# Altium project Timing Display Board v1.1.PrjPcb (part 2 of 2)

## Sheet Interface.SchDoc
size OrCAD C; SheetNumber: 7; SheetTotal: 7
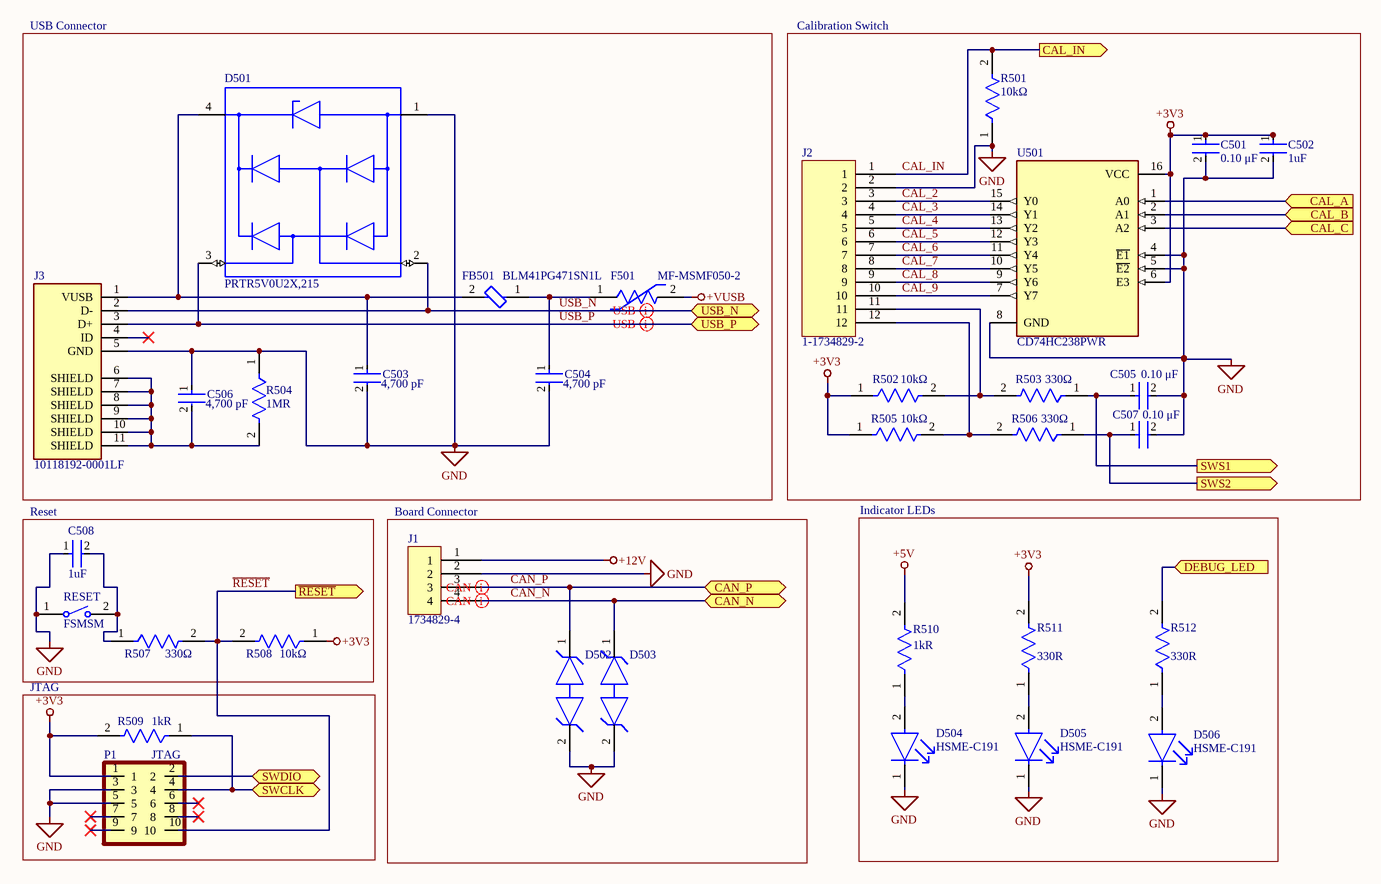
[diagram p5: Interface.SchDoc]

### Parts
C501  Capacitance: 0.10 μF  [FP-C0603C-CF-MFG]  (hidden comment: C0603C104K5RACAUTO)
C502  Capacitance: 1uF  [FP-C0603C-CJ-MFG]  (hidden comment: C0603C105K4RACAUTO)
C503  Capacitance: 4,700 pF  [FP-C0603C-CF-MFG]  (hidden comment: C0603C472K5RACAUTO)
C504  Capacitance: 4,700 pF  [FP-C0603C-CF-MFG]  (hidden comment: C0603C472K5RACAUTO)
C505  Capacitance: 0.10 μF  [FP-C0603C-CF-MFG]  (hidden comment: C0603C104K5RACAUTO)
C506  Capacitance: 4,700 pF  [FP-C0603C-CF-MFG]  (hidden comment: C0603C472K5RACAUTO)
C507  Capacitance: 0.10 μF  [FP-C0603C-CF-MFG]  (hidden comment: C0603C104K5RACAUTO)
C508  Capacitance: 1uF  [FP-C0603C-CJ-MFG]  (hidden comment: C0603C105K4RACAUTO)
D501  PRTR5V0U2X,215  [FP-SOT143B-MFG]
D502  SD24C-01FTG  [FP-SD-C-MFG]  (value not drawn)
D503  SD24C-01FTG  [FP-SD-C-MFG]  (value not drawn)
D504  HSME-C191  [FP-HSME-C191-MFG]
D505  HSME-C191  [FP-HSME-C191-MFG]
D506  HSME-C191  [FP-HSME-C191-MFG]
F501  MF-MSMF050-2  [FP-MF-MSMF050-2-MFG]
FB501  BLM41PG471SN1L  [FP-BLM41-0_2-a1_2-IPC_B]
J1  1734829-4  [1734829-4]
J2  1-1734829-2  [1-1734829-2]
J3  10118192-0001LF  [101181920001LF]
P1  JTAG  [FCI_20021111-00010T4LF]
R501  Resistance: 10kΩ  [FP-RMCF0603-IPC_C]  (hidden comment: RMCF0603JT10K0)
R502  Resistance: 10kΩ  [FP-RMCF0603-IPC_C]  (hidden comment: RMCF0603JT10K0)
R503  Resistance: 330Ω  [FP-RMCF0603-MFG]  (hidden comment: RMCF0603JT330R)
R504  Resistance: 1MR  [FP-RMCF0603-IPC_B]  (hidden comment: RMCF0603JT1M00)
R505  Resistance: 10kΩ  [FP-RMCF0603-IPC_C]  (hidden comment: RMCF0603JT10K0)
R506  Resistance: 330Ω  [FP-RMCF0603-MFG]  (hidden comment: RMCF0603JT330R)
R507  Resistance: 330Ω  [FP-RMCF0603-MFG]  (hidden comment: RMCF0603JT330R)
R508  Resistance: 10kΩ  [FP-RMCF0603-IPC_C]  (hidden comment: RMCF0603JT10K0)
R509  Resistance: 1kR  [FP-RMCF0603-IPC_C]  (hidden comment: RMCF0603JT1K00)
R510  Resistance: 1kR  [FP-TNPW0603-e3-IPC_B]  (hidden comment: TNPW06031K00BEEA)
R511  Resistance: 330R  [FP-RMCF0603-MFG]  (hidden comment: RMCF0603FT330R)
R512  Resistance: 330R  [FP-RMCF0603-MFG]  (hidden comment: RMCF0603FT330R)
RESET  FSMSM  [TECO-FSMSM-2_V]
U501  CD74HC238PWR  [FP-PW0016A-IPC_B]

### Blocks framed on the sheet
USB Connector: C503 C504 C506 D501 F501 FB501 J3 R504
Calibration Switch: C501 C502 C505 C507 J2 R501-R503 R505 R506 U501
Reset: C508 R507 R508 RESET
Board Connector: D502 D503 J1
Indicator LEDs: D504-D506 R510-R512
JTAG: P1 R509

### Ports
CAL_A (in), CAL_B (in), CAL_C (in), CAL_IN (out), CAN_N (bidir), CAN_P (bidir), DEBUG_LED (in), SWCLK (bidir), SWDIO (bidir), SWS1 (out), SWS2 (out), USB_N (bidir), USB_P (bidir), ~{RESET} (out)

### Nets
+3V3: C501.1 C502.1 P1.1 R502.1 R505.1 R508.1 R509.2 R511.2 U501.6(E3) U501.16(VCC)
+5V: R510.2
+12V: J1.1
+VUSB: F501.2
GND: C501.2 C502.2 C503.2 C504.2 C505.2 C506.1 C507.2 C508.1 D501.1(GND) D502.2 D503.2 D504.1(C) D505.1(C) D506.1(C) J1.2 J2.2 J3.5(GND) P1.3 P1.5 R501.1 R504.1 RESET.1 U501.4(~{E1}) U501.5(~{E2}) U501.8(GND)
CAL_2: J2.3 U501.15(Y0)
CAL_3: J2.4 U501.14(Y1)
CAL_4: J2.5 U501.13(Y2)
CAL_5: J2.6 U501.12(Y3)
CAL_6: J2.7 U501.11(Y4)
CAL_7: J2.8 U501.10(Y5)
CAL_8: J2.9 U501.9(Y6)
CAL_9: J2.10 U501.7(Y7)
CAL_A: U501.1(A0) ; port CAL_A
CAL_B: U501.2(A1) ; port CAL_B
CAL_C: U501.3(A2) ; port CAL_C
CAL_IN: J2.1 R501.2 ; port CAL_IN
CAN_N: D503.1 J1.4 ; port CAN_N
CAN_P: D502.1 J1.3 ; port CAN_P
DEBUG_LED: R512.2 ; port DEBUG_LED
~{RESET}: P1.10 R507.2 R508.2 ; port ~{RESET}
SWCLK: P1.4 R509.1 ; port SWCLK
SWDIO: P1.2 ; port SWDIO
SWS1: C505.1 R503.1 ; port SWS1
SWS2: C507.1 R506.1 ; port SWS2
USB_N: D501.2(I/O_1) J3.2(D-) ; port USB_N
USB_P: D501.3(I/O_2) J3.3(D+) ; port USB_P
NetC503_1: C503.1 D501.4(VCC) FB501.2 J3.1(VUSB)
NetC504_1: C504.1 F501.1 FB501.1
NetC506_2: C506.2 J3.6(SHIELD) J3.7(SHIELD) J3.8(SHIELD) J3.9(SHIELD) J3.10(SHIELD) J3.11(SHIELD) R504.2
NetC508_2: C508.2 R507.1 RESET.2
NetD504_2: D504.2(A) R510.1
NetD505_2: D505.2(A) R511.1
NetD506_2: D506.2(A) R512.1
NetJ2_11: J2.11 R502.2 R503.2
NetJ2_12: J2.12 R505.2 R506.2

Not connected (* = marked no-connect by the designer): J3 4(ID)*; P1 6* 7* 8* 9*

### Layout directives
differential pair: CAN_N, CAN_P, USB_N, USB_P

### Library data of the parts
C501 C505 C507 = CMP-2006-03060-2: CAP CER 0.1UF 50V X7R 0603; Manufacturer: KEMET; Tolerance: 0.1; Material: Ceramic; Value: 0.10 μF; Automotive Grade: Grade 1; Temperature Coefficient: 30ppm/°C; RoHS: TRUE; Temperature Range Low: -55°C; Automotive: Yes; Octopart: https://octopart.com/c0603c104k5racauto-kemet-12563741; Temperature Characteristic: X7R; Category: Cap; Voltage Rating: 50 V; Mouser Description: Multilayer Ceramic Capacitors MLCC - SMD/SMT 0.1uF 50volts 10% X7R AUTO; ComponentLink2Description: Datasheet; Device Class L2: Capacitors; Digikey Description: CAP CER 0.1UF 50V X7R 0603; Manufacturer Part Number: C0603C104K5RACAUTO; ComponentLink2URL: https://api.kemet.com/component-edge/download/datasheet/C0603C100J5GACAUTO.pdf; Lead Free: Yes; Height: 0.87mm; Device Class L3: Ceramic Capacitors; Device Class L1: Passive Components; Temperature Range High: +125°C; Package: C0603C-CF; Temperature: -55°C to +125°C
C502 C508 = CMP-03020-014193-1: CAP CER 0603 1UF 16V X7R 10%; Manufacturer: KEMET; Temperature Coefficient: 15%; Automotive Grade: Grade 1; Material: Ceramic; Digikey Description: CAP CER 0603 1UF 16V X7R 10%; Octopart: https://octopart.com/c0603c105k4racauto-kemet-91328491; Package: C0603C-CJ; ComponentLink2Description: Datasheet; Mouser Description: Cap Ceramic 1uF 16V X7R 10% Pad SMD 0603 125C Automotive T/R; Automotive: Yes; Tolerance: 10%; Manufacturer Part Number: C0603C105K4RACAUTO; Lead Free: Yes; Temperature: -55°C to +125°C; ComponentLink2URL: https://content.kemet.com/datasheets/KEM_C1023_X7R_AUTO_SMD.pdf; Temperature Range Low: -55°C; Ipc Land Pattern Name: CAPC16080X80; Device Class L1: Passive Components; Temperature Characteristic: X7R; Device Class L2: Capacitors; Height: 0.95mm; Device Class L3: Ceramic Capacitors; RoHS: TRUE; Category: Cap; Temperature Range High: +125°C; Value: 1uF; Voltage Rating: 16V
C503 C504 C506 = CMP-2006-03717-2: CAP CER 4700PF 50V X7R 0603; Manufacturer: KEMET; Automotive Grade: Grade 1; Material: Ceramic; Tolerance: 0.1; Value: 4,700 pF; Temperature Coefficient: 30ppm/°C; Device Class L3: Ceramic Capacitors; Manufacturer Part Number: C0603C472K5RACAUTO; Octopart: https://octopart.com/c0603c472k5racauto-kemet-20122456; RoHS: TRUE; Temperature Range Low: -55°C; Temperature Characteristic: X7R; Device Class L1: Passive Components; ComponentLink2Description: Datasheet; Temperature: -55°C to +125°C; Package: C0603C-CF; ComponentLink2URL: https://api.kemet.com/component-edge/download/datasheet/C0603C100J5GACAUTO.pdf; Device Class L2: Capacitors; Voltage Rating: 50 V; Digikey Description: CAP CER 4700PF 50V X7R 0603; Temperature Range High: +125°C; Height: 0.87mm; Category: Cap; Lead Free: Yes; Mouser Description: Cap Ceramic 0.0047uF 50V X7R 10% Pad SMD 0603 125C Automotive T/R; Automotive: Yes
D501 = CMP-14436-000007-1: TVS DIODE 5.5V SOT143B
D502 D503 = CMP-08607-000005-1: TVS DIODE 24V 42V SOD323; Manufacturer: Littelfuse; Peak Pulse Power: 450W; Direction: Bidirectional; Standoff Height: 0mm; Capacitance: 50pF; Number Of Channels: 1; Value: 50pF; Breakdown Voltage: 26.7V; Peak Pulse Current: 7A; Automotive Grade: Grade 1; Category: Diode; Mouser Description: In a Pack of 25, Littelfuse SD24C-01FTG, Bi-Directional TVS Diode Array, 450W, 2-Pin SOD-323; Height: 1.14mm; Manufacturer Part Number: SD24C-01FTG; Octopart: https://octopart.com/sd24c-01ftg-littelfuse-46947705; Temperature Range High: +125°C; Reverse Standoff Voltage: 24V; ComponentLink2Description: Datasheet; Device Class L2: TVS Diodes; Lead Free: Yes; Automotive: Yes; Temperature Range Low: -40°C; Device Class L3: unset; Device Class L1: Circuit Protection; ComponentLink2URL: https://www.littelfuse.com/~/media/electronics/datasheets/tvs_diode_arrays/littelfuse_tvs_diode_array_sd_c_datasheet.pdf.pdf; Clamping Voltage: 42V; Digikey Description: TVS DIODE 24V 42V SOD323; RoHS: TRUE; Temperature: -40°C to +125°C; Package: SD-C
D504-D506 = CMP-18399-000013-1: LED GREEN DIFFUSED 0603 SMD; Manufacturer: Broadcom; Forward Current: 20mA; Reverse Voltage: 5V; Forward Voltage: 2.1V; Viewing Angle: 170°; Wavelength: 572nm; Power Dissipation: 52mW; Max Junction Temp: +95°C; Luminous Intensity: 50mcd; Led Orientation: Top View; Description: LED Uni-Color Green 570nm 2-Pin Chip LED T/R; Peak Emmision Wavelength: 570nm; Package: 0; Category: Diode; ComponentLink2URL: https://docs.broadcom.com/docs/AV02-0976EN; ComponentLink2Description: Datasheet; Device Class L2: LEDs; Digikey Description: LED GREEN DIFFUSED 0603 SMD; Height: 0.7mm; RoHS: TRUE; Colour: Green; Lead Free: Yes; Device Class L1: Optoelectronics; Device Class L3: unset; Temperature Range High: +85°C; Manufacturer Part Number: HSME-C191; Automotive: No; Temperature: -40°C to +85°C; Octopart: https://octopart.com/hsme-c191-broadcom-71131261; Mouser Description: Standard LEDs - SMD AlInGaP Green; Temperature Range Low: -40°C
F501 = CMP-2100-03653-2: PTC RESET FUSE 15V 500MA 1812; Manufacturer: Bourns; Value: 0.15-1Ω; Trip Current: 1A; Automotive Grade: Grade 3; Trip Time: 0.15s; Current Rating: 100A; Hold Current: 0.5A; Height: 0.85mm; Package: 1812; Voltage Rating: 15V; Temperature Range High: +85°C; Device Class L2: PTC Resettable Fuses; Lead Free: Yes; ComponentLink2URL: http://www.bourns.com/docs/Product-Datasheets/mfmsmf.pdf; Ambient Temperature Range High: +85°C; Mouser Description: PTC Resettable Fuse 0.5A(hold) 1A(trip) 15V 100A 0.8W 0.15s 0.15Ohm SMD Solder Pad 1812 T/R; Digikey Description: PTC RESET FUSE 15V 500MA 1812; Manufacturer Part Number: MF-MSMF050-2; Resistance: 0.15-1Ω; Category: Fuse; ComponentLink2Description: Datasheet; Automotive: Yes; Temperature Range Low: -40°C; RoHS: TRUE; Device Class L1: Circuit Protection; Temperature: -40°C to +85°C; Octopart: https://octopart.com/mf-msmf050-2-bourns-28047; Ambient Temperature Range Low: -40°C; Device Class L3: unset
FB501 = CMP-0686-00760-3: Ferrite Bead, 1806, 470Ω @ 100MHz, 25%, 0.05Ω, 2A; Material: Steel; Number of Circuits: 1; Shielding: Unshielded; DC Resistance (DCR): 50mR; Impedance: 470R; Min Operating Temperature: -55°C; Case/Package: 1806; Packaging: Tape and Reel; DC Current: 2A; Frequency: 100MHz; Length: 4.5mm; Max Operating Temperature: 125°C; Package Quantity: 1; Max Current Rating: 2A; Radiation Hardening: No; RoHS Compliant: Yes; Lead Free: Lead Free; Height: 1.6mm; Test Frequency: 100MHz; Series: BLM41P; Width: 1.6mm; Core Material: Ferrite; Case Code (Imperial): 1806; Termination: SMD/SMT; Tolerance: 25%; Number of Pins: 2; Number of Lines: 1; Case Code (Metric): 4516; Current Rating: 2A; Max DC Current: 2A; DC Resistance-Max: 50mR; Depth: 1.6mm; Military Standard: Not
J1 = 1734829-4: Headers & Wire Housings 4 POS HDR R/A 1.25mm; Supplier 1: Mouser; Supplier Part Number 1: 571-1734829-4
J2 = 1-1734829-2: Headers & Wire Housings 12 POS HDR R/A 1.25mm; Supplier 1: Mouser; Supplier Part Number 1: 571-1-1734829-2
J3 = CMP-005-000001-1: Connector; Manufacturer_Name: Amphenol; Mouser2 Price/Stock: https://www.mouser.com/Search/Refine.aspx?Keyword=649-10118192-0001LF; Source: SamacSys.SchLib; Design Item ID: 10118192-0001LF; Manufacturer_Part_Number: 10118192-0001LF; Datasheet Link: https://componentsearchengine.com//10118192-0001LF.pdf; Height: 2.8mm; Mouser2 Part Number: 649-10118192-0001LF
P1 = 20021111-00010T4LF: 1.27x1.27MM BTB, HEADER UNSHROUDED, VERTICAL, TH, 10 POSITIONSÂ£Â¬Double row; MF: {'manufacturer': u'AMPHENOL ICC / FCI'}; Value: *; MP: 20021111-00010T4LF; Package: None; Price: None; Availability: Unavailable
R501 R502 R505 R508 = CMP-26527-002098-1: 10kΩ ±5% 0.1W 0603 Thick Film Chip Resistor AEC-Q200 compliant; Power Rating: 100mW; Temperature Coefficient: 100ppm/°C; Radiation Hardening: No; Military Standard: Not; Mount: Surface Mount; Resistor Type: Thick Film; Size Code: 0603; Case/Package: 0603; Min Operating Temperature: -55°C; Construction: Rectangular; Series: RMCF; Width: 0.031inch; Length: 1.55mm; Case Code (Metric): 1608; Depth: 0.8mm; Height: 0.022inch; Packaging: Tape and Reel; Lead Free: Lead Free; Tolerance: 5%; Case Code (Imperial): 0603; Max Operating Temperature: 155°C; Contact Plating: Tin; Max Power Dissipation: 100mW; Features: Automotive AEC-Q200; Number of Terminations: 2
R503 R506 R507 = CMP-26527-004280-1: 330Ω ±5% 0.1W 0603 Thick Film Chip Resistor AEC-Q200 compliant; Temperature Coefficient: 100ppm/°C; Power Rating: 100mW; Working Voltage: 75V; Radiation Hardening: No; Series: RMCF; Technology: THICK FILM; Construction: Rectangular; Case/Package: 0603; Contact Plating: Tin; Length: 1.55mm; Max Operating Temperature: 155°C; Military Standard: Not; Height: 0.022inch; Case Code (Imperial): 0603; Width: 0.031inch; RoHS Compliant: Yes; Tolerance: 5%; Mount: Surface Mount; Depth: 0.8mm; Case Code (Metric): 1608; Lead Free: Lead Free; Resistor Type: Thick Film; Min Operating Temperature: -55°C; Number of Terminations: 2; Packaging: Tape and Reel; Max Power Dissipation: 100mW; Features: Automotive AEC-Q200
R504 = CMP-26527-000361-1: 1MΩ ±5% 0.1W 0603 Thick Film Chip Resistor AEC-Q200 compliant; Max Power Dissipation: 100mW; Working Voltage: 75V; Temperature Coefficient: 200ppm/°C; Mount: Surface Mount; Resistor Type: Thick Film; Case Code (Imperial): 0603; Lead Free: Lead Free; Tolerance: 5%; Min Operating Temperature: -55°C; Construction: Rectangular; Depth: 0.8mm; Series: RMCF; RoHS Compliant: Yes; Width: 0.031inch; Height: 0.022inch; Case Code (Metric): 1608; Power Rating: 100mW; Military Standard: Not; Technology: THICK FILM; Radiation Hardening: No; Length: 1.55mm; Case/Package: 0603; Contact Plating: Tin; Packaging: Tape and Reel; Features: Automotive AEC-Q200; Number of Terminations: 2; Max Operating Temperature: 155°C
R509 = CMP-26527-001474-1: 1kΩ ±5% 0.1W 0603 Thick Film Chip Resistor AEC-Q200 compliant; Temperature Coefficient: 100ppm/°C; Power Rating: 100mW; Working Voltage: 75V; Width: 0.031inch; Resistor Type: Thick Film; Technology: THICK FILM; Construction: Rectangular; Case Code (Metric): 1608; Min Operating Temperature: -55°C; Length: 1.55mm; Military Standard: Not; Radiation Hardening: No; Contact Plating: Tin; Lead Free: Lead Free; Case Code (Imperial): 0603; Mount: Surface Mount; Case/Package: 0603; RoHS Compliant: Yes; Max Operating Temperature: 155°C; Series: RMCF; Tolerance: 5%; Number of Terminations: 2; Features: Automotive AEC-Q200; Packaging: Tape and Reel; Depth: 0.8mm; Max Power Dissipation: 100mW; Height: 0.022inch
R510 = CMP-2000-03717-2: RES 1K OHM 0.1% 1/8W 0603; Max Power Dissipation: 125mW; Power Rating: 100mW; Temperature Coefficient: 25ppm/°C; Voltage Rating (DC): 75V; RoHS Compliant: Yes; Min Operating Temperature: -55°C; Radiation Hardening: No; Weight: 7.1E-05oz; Size Code: 0603; Height: 0.45mm; Construction: Rectangular; Case/Package: 0603; Package Quantity: 1; Case Code (Imperial): 0603; Depth: 0.85mm; Packaging: Tape and Reel; Series: TNPW e3; Max Operating Temperature: 125°C; Technology: THIN FILM; Mount: Surface Mount; Contact Plating: Tin; Width: 0.033inch; Resistor Type: Thin Film; Length: 1.6mm; Resistance Tolerance: 0.1%; Termination: SMD/SMT; Lead Free: Lead Free; Voltage Rating: 75V; Case Code (Metric): 1608; Military Standard: Not; Number of Terminations: 2; Features: Moisture Resistant
R511 R512 = CMP-26527-005052-1: 330Ω ±1% 0.1W 0603 Thick Film Chip Resistor AEC-Q200 compliant; Temperature Coefficient: 100ppm/°C; Max Power Dissipation: 100mW; Resistor Type: Thick Film; Lead Free: Lead Free; Case Code (Imperial): 0603; Radiation Hardening: No; Contact Plating: Tin; Min Operating Temperature: -55°C; Depth: 0.8mm; Series: RMCF; Case Code (Metric): 1608; Number of Terminations: 2; RoHS Compliant: Yes; Max Operating Temperature: 155°C; Construction: Rectangular; Case/Package: 0603; Packaging: Tape and Reel; Length: 0.061inch; Military Standard: Not; Height: 0.022inch; Width: 0.031inch; Features: Automotive AEC-Q200; Tolerance: 1%; Mount: Surface Mount
RESET = CMP-2000-07511-1: FSMSM Push Button Switch, 50 mA, -35 to 85 degC, 2-Pin SMD, RoHS, Bulk; Manufacturer: TE Connectivity; Actuator Length: 1.07mm; Electrical Life: 20000Cycles; Actuator Material: Polyamide; Current Rating: 50mA; Illumination Type: Illuminated; Voltage Rating (DC): 24V; Contact Resistance: 100mOhm; Case\/Package: SMD/SMT; Operating Force: 180gf; Switch Travel: 0.25mm; Max Voltage Rating (DC): 12V; Throw Configuration: SPST; Packaging: LoosePiece; Max Operating Temperature: 85degC; ELV: Compliant; Package Description: 2-Pin Surface Mount Device, Body 6 x 3.5 mm, Pitch 9.19 mm; RoHSCompliant: true; Manufacturer URL: http://www.te.com/; Contact Plating: Silver; Contact Material: Brass; Mounting Technology: SurfaceMount; Contact Current Rating: 50mA; Datasheet Version: Rev. C2, 08/2014; Datasheet URL: http://www.te.com/commerce/DocumentDelivery/DDEController?Action=showdoc&DocId=Customer+Drawing%7F1437566-3%7FC2%7Fpdf%7FEnglish%7FENG_CD_1437566-3_C2_1437566_3_1_c.dwg.pdf%7F1437566-3; Mechanical Life: 20000Cycles; Package Reference: FSMSM; REACH SVHC: Unknown; Orientation: Straight; Min Operating Temperature: -35degC; Lead Free: LeadFree; Termination: GullWing; Package Quantity: 1000; Mount: SurfaceMount
U501 = CMP-1633-00899-3: IC DECODER/DEMUX 1X3:8 16TSSOP; Max Supply Voltage: 6V; Low Level Output Current: 5.2mA; Number of Channels: 1; Quiescent Current: 8uA; Min Supply Voltage: 2V; Supply Type: Single; Polarity: Non-Inverting; Number of Input Lines: 3; Output Current: 25mA; Turn-On Delay Time: 265ns; Number of Output Lines: 8; Logic Function: Demultiplexer; High Level Output Current: -5.2mA; Rise Time: 400ns; Bandwidth: 28MHz; Max Operating Temperature: 125°C; Independent Circuits: 1; Weight: 0.002183oz; Radiation Hardening: No; Output Voltage: 6V; Min Operating Temperature: -55°C; Package Quantity: 2000; REACH SVHC: No SVHC; Packaging: Tape and Reel; Lead Free: Lead Free; Contact Plating: Gold; Mount: Surface Mount; Height: 1.15mm; Case/Package: TSSOP; Number of Bits: 8; Number of Inputs: 3; Termination: SMD/SMT; Number of Outputs: 8; Number of Pins: 16; Number of Circuits: 1; Max Supply Current: 8uA; Series: 74HC; Number of Elements: 1; RoHS Compliant: Yes; Length: 5mm; Propagation Delay: 265ns; Width: 4.4mm; Technology: CMOS; Max Frequency: 28MHz

## Sheet CANbus.SchDoc
size OrCAD C; SheetNumber: 6; SheetTotal: 7
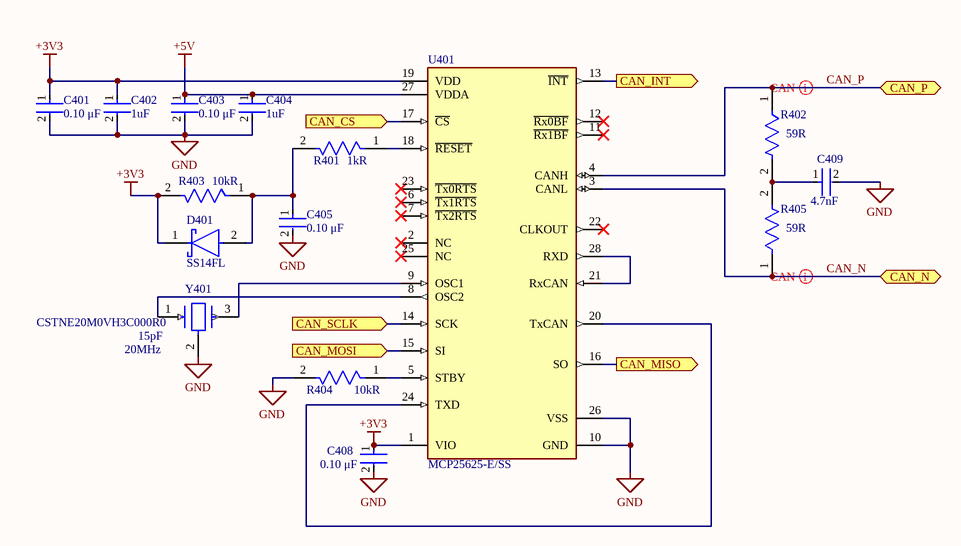
[diagram p6: CANbus.SchDoc]

### Parts
C401  Capacitance: 0.10 μF  [FP-C0603C-CF-MFG]  (hidden comment: C0603C104K5RACAUTO)
C402  Capacitance: 1uF  [FP-C0603C-CJ-MFG]  (hidden comment: C0603C105K4RACAUTO)
C403  Capacitance: 0.10 μF  [FP-C0603C-CF-MFG]  (hidden comment: C0603C104K5RACAUTO)
C404  Capacitance: 1uF  [FP-C0603C-CJ-MFG]  (hidden comment: C0603C105K4RACAUTO)
C405  Capacitance: 0.10 μF  [FP-C0603C-CF-MFG]  (hidden comment: C0603C104K5RACAUTO)
C408  Capacitance: 0.10 μF  [FP-C0603C-CF-MFG]  (hidden comment: C0603C104K5RACAUTO)
C409  Capacitance: 4.7nF  [FP-GRM155-0_05-MFG]  (hidden comment: GRM155R72A472KA01D)
D401  SS14FL  [FP-425AD-MFG]
R401  Resistance: 1kR  [FP-RMCF0603-IPC_C]  (hidden comment: RMCF0603JT1K00)
R402  Resistance: 59R  [FP-CRCW0603-HPe3-IPC_A]  (hidden comment: CRCW060359R0FKEAHP)
R403  Resistance: 10kR  [FP-RMCF0603-IPC_C]  (hidden comment: RMCF0603JT10K0)
R404  Resistance: 10kR  [FP-RMCF0603-IPC_C]  (hidden comment: RMCF0603JT10K0)
R405  Resistance: 59R  [FP-CRCW0603-HPe3-IPC_A]  (hidden comment: CRCW060359R0FKEAHP)
U401  MCP25625-E/SS  [FP-C04-073-MFG]
Y401  CSTNE20M0VH3C000R0  Frequency: 20MHz  Capacitance: 15pF  [FP-CSTNE20M0VH3C000R0-MFG]

### Ports
CAN_CS (in), CAN_INT (out), CAN_MISO (out), CAN_MOSI (in), CAN_N (bidir), CAN_P (bidir), CAN_SCLK (in)

### Nets
+3V3: C401.1 C402.1 C408.1 D401.1(C) R403.2 U401.1(VIO) U401.19(VDD)
+5V: C403.1 C404.1 U401.27(VDDA)
GND: C401.2 C402.2 C403.2 C404.2 C405.2 C408.2 C409.2 R404.2 U401.10(GND) U401.26(VSS) Y401.2(GND)
CAN_CS: U401.17(~{CS}) ; port CAN_CS
CAN_INT: U401.13(~{INT}) ; port CAN_INT
CAN_MISO: U401.16(SO) ; port CAN_MISO
CAN_MOSI: U401.15(SI) ; port CAN_MOSI
CAN_N: R405.1 U401.3(CANL) ; port CAN_N
CAN_P: R402.1 U401.4(CANH) ; port CAN_P
CAN_SCLK: U401.14(SCK) ; port CAN_SCLK
NetC405_1: C405.1 D401.2(A) R401.2 R403.1
NetC409_1: C409.1 R402.2 R405.2
NetR401_1: R401.1 U401.18(~{RESET})
NetR404_1: R404.1 U401.5(STBY)
NetU401_8: U401.8(OSC2) Y401.1(Input)
NetU401_9: U401.9(OSC1) Y401.3(Output)
NetU401_20: U401.20(TxCAN) U401.24(TXD)
NetU401_21: U401.21(RxCAN) U401.28(RXD)

Not connected (* = marked no-connect by the designer): U401 2(NC)* 6(~{Tx1RTS})* 7(~{Tx2RTS})* 11(~{Rx1BF})* 12(~{Rx0BF})* 22(CLKOUT)* 23(~{Tx0RTS})* 25(NC)*

### Layout directives
differential pair: CAN_N, CAN_P

### Library data of the parts
C401 C403 C405 C408 = CMP-2006-03060-2: as C501 on sheet Interface; RoHS: TRUE; Temperature Range Low: -55°C; Automotive: Yes; Octopart: https://octopart.com/c0603c104k5racauto-kemet-12563741; Temperature Characteristic: X7R; Category: Cap; Voltage Rating: 50 V; Mouser Description: Multilayer Ceramic Capacitors MLCC - SMD/SMT 0.1uF 50volts 10% X7R AUTO; ComponentLink2Description: Datasheet; Device Class L2: Capacitors; Digikey Description: CAP CER 0.1UF 50V X7R 0603; Manufacturer Part Number: C0603C104K5RACAUTO; ComponentLink2URL: https://api.kemet.com/component-edge/download/datasheet/C0603C100J5GACAUTO.pdf; Lead Free: Yes; Height: 0.87mm; Device Class L3: Ceramic Capacitors; Device Class L1: Passive Components; Temperature Range High: +125°C; Package: C0603C-CF; Temperature: -55°C to +125°C
C402 C404 = CMP-03020-014193-1: as C502 on sheet Interface; Digikey Description: CAP CER 0603 1UF 16V X7R 10%; Octopart: https://octopart.com/c0603c105k4racauto-kemet-91328491; Package: C0603C-CJ; ComponentLink2Description: Datasheet; Mouser Description: Cap Ceramic 1uF 16V X7R 10% Pad SMD 0603 125C Automotive T/R; Automotive: Yes; Tolerance: 10%; Manufacturer Part Number: C0603C105K4RACAUTO; Lead Free: Yes; Temperature: -55°C to +125°C; ComponentLink2URL: https://content.kemet.com/datasheets/KEM_C1023_X7R_AUTO_SMD.pdf; Temperature Range Low: -55°C; Ipc Land Pattern Name: CAPC16080X80; Device Class L1: Passive Components; Temperature Characteristic: X7R; Device Class L2: Capacitors; Height: 0.95mm; Device Class L3: Ceramic Capacitors; RoHS: TRUE; Category: Cap; Temperature Range High: +125°C; Value: 1uF; Voltage Rating: 16V
C409 = CMP-2008-03941-2: Chip Multilayer Ceramic Capacitors for General Purpose, 0402, 4700pF, X7R, 15%, 10%, 100V; Depth: 0.5mm; Case/Package: 0402; Radiation Hardening: No; Height: 0.5mm; Length: 1mm; Dielectric: X7R; Thickness: 0.022inch; Voltage: 100V; Case Code (Metric): 1005; Mount: Surface Mount; Packaging: Tape and Reel; Voltage Rating (DC): 100V; Termination: SMD/SMT; Width: 0.5mm; Tolerance: 10%; Min Operating Temperature: -55°C; Case Code (Imperial): 0402; Voltage Rating: 100V; Max Operating Temperature: 125°C; Lead Free: Lead Free; Package Quantity: 1
D401 = CMP-07162-000013-1: DIODE SCHOTTKY 40V 1A SOD123F; Manufacturer: ON Semiconductor; Max Junction Temp: +125°C; Value: 60pF; Max Surge Forward Current: 40A; Peak Reverse Current: 30uA; Device Class L3: Schottky Diodes; Reverse Voltage: 40V; Automotive: No; Temperature: -55°C to +125°C; Mouser Description: SS14FL Series 40 V 1 A Surface Mount Schottky Barrier Rectifier - SOD-123F; Octopart: https://octopart.com/ss14fl-on+semiconductor-84331601; Height: 1.08mm; Temperature Range Low: -55°C; Category: Diode; Lead Free: Yes; Device Class L1: Discrete Semiconductors; Digikey Description: DIODE SCHOTTKY 40V 1A SOD123F; RoHS: TRUE; ComponentLink2Description: Datasheet; Manufacturer Part Number: SS14FL; Forward Current: 1A; Capacitance: 60pF; Package: 425AD; Device Class L2: Diodes; Temperature Range High: +125°C; Max Repetitive Reverse Voltage: 40V; ComponentLink2URL: https://www.onsemi.com/pub/Collateral/SS14FL-D.PDF
R401 = CMP-26527-001474-1: as R509 on sheet Interface; Width: 0.031inch; Resistor Type: Thick Film; Technology: THICK FILM; Construction: Rectangular; Case Code (Metric): 1608; Min Operating Temperature: -55°C; Length: 1.55mm; Military Standard: Not; Radiation Hardening: No; Contact Plating: Tin; Lead Free: Lead Free; Case Code (Imperial): 0603; Mount: Surface Mount; Case/Package: 0603; RoHS Compliant: Yes; Max Operating Temperature: 155°C; Series: RMCF; Tolerance: 5%; Number of Terminations: 2; Features: Automotive AEC-Q200; Packaging: Tape and Reel; Depth: 0.8mm; Max Power Dissipation: 100mW; Height: 0.022inch
R402 R405 = CMP-02407-004126-1: RES Thick Film, 59Ω, 1%, 0.33W, 100ppm/°C, 0603; Voltage Rating: 75V; Power Rating: 250mW; Case Code (Metric): 1608; Packaging: Tape and Reel; Features: Automotive AEC-Q200; Min Operating Temperature: -55°C; Case Code (Imperial): 0603; Length: 1.6mm; Width: 0.033inch; Radiation Hardening: No; Number of Terminations: 2; Depth: 0.85mm; Termination: SMD/SMT; Case/Package: 0603; Height: 0.45mm; Tolerance: 1%; Weight: 7.1E-05oz; Temperature Coefficient: 100ppm/°C; Contact Plating: Tin; Max Operating Temperature: 155°C; Composition: Thick Film; Max Power Dissipation: 250mW; Lead Free: Lead Free; Package Quantity: 10
R403 R404 = CMP-26527-002098-1: as R501 on sheet Interface; Radiation Hardening: No; Military Standard: Not; Mount: Surface Mount; Resistor Type: Thick Film; Size Code: 0603; Case/Package: 0603; Min Operating Temperature: -55°C; Construction: Rectangular; Series: RMCF; Width: 0.031inch; Length: 1.55mm; Case Code (Metric): 1608; Depth: 0.8mm; Height: 0.022inch; Packaging: Tape and Reel; Lead Free: Lead Free; Tolerance: 5%; Case Code (Imperial): 0603; Max Operating Temperature: 155°C; Contact Plating: Tin; Max Power Dissipation: 100mW; Features: Automotive AEC-Q200; Number of Terminations: 2
U401 = CMP-06279-000004-1: IC TXRX CAN CTLR EXT TEMP 28SSOP; Manufacturer: Microchip; Min Supply Voltage: 2.7V; Interface: SPI,CAN; Max Supply Voltage: 5.5V; Automotive Grade: Grade 1; Nominal Supply Current: 10mA; Standoff Height: 0.05mm; Max Junction Temp: +150°C; Octopart: https://octopart.com/mcp25625-e%2Fss-microchip-38886007; Digikey Description: IC TXRX CAN CTLR EXT TEMP 28SSOP; Automotive: Yes; Lead Free: Yes; Package: C04-073; Device Class L3: unset; Device Class L1: Integrated Circuits (ICs); Ambient Temperature Range Low: -40°C; Device Class L2: Interface ICs; ComponentLink2URL: http://ww1.microchip.com/downloads/en/DeviceDoc/MCP25625-CAN-Controller-Data-Sheet-20005282C.pdf; Ambient Temperature Range High: +125°C; Height: 2mm; Mouser Description: CAN Interface IC CAN Controller with Int. Transceiver; RoHS: TRUE; Temperature: -40°C to +125°C; Ipc Land Pattern Name: SOP65P780X200-28; Manufacturer Part Number: MCP25625-E/SS; ComponentLink2Description: Datasheet; Temperature Range High: +125°C; Temperature Range Low: -40°C; Category: IC
Y401 = CMP-06057-000018-1: CERAMIC RES 20.0000MHZ 15PF SMD; Frequency Stability: 0.13%; Frequency Tolerance: 0.07%; Impedance: 40R; RoHS Compliant: Yes; Packaging: Cut Tape; Mount: Surface Mount; Case/Package: SMD/SMT; Max Operating Temperature: 125°C; Min Operating Temperature: -40°C; Resistor Type: Ceramic

## Nets that join several sheets
+3V3: SAMD (9 pins), Power (C103.1 C104.1 U101.5), Interface (10 pins), CANbus (7 pins)
+5V: Power (6 pins), Display Driver (C201.1 C202.1 R201.1 U201.19), Interface (R510.2), CANbus (C403.1 C404.1 U401.27)
+12V: Power (5 pins), Interface (J1.1)
+VUSB: Power (Q101.3), Interface (F501.2)
GND: SAMD (13 pins), Power (13 pins), Display Driver (C201.2 C202.2 U201.6), Interface (25 pins), CANbus (11 pins)
A0: Display Driver (U201.2), DISPLAY/0 (7 pins)
A1: Display Driver (U201.3), DISPLAY/1 (7 pins)
A2: Display Driver (U201.4), DISPLAY/2 (7 pins)
A3: Display Driver (U201.5), DISPLAY/3 (7 pins)
A4: Display Driver (U201.7), DISPLAY/4 (7 pins)
A5: Display Driver (U201.8), DISPLAY/5 (7 pins)
A6: Display Driver (U201.9), DISPLAY/6 (7 pins)
A7: Display Driver (U201.10), DISPLAY/7 (7 pins)
CA: Display Driver (U201.15), DISPLAY/0 (Ra_0.2), DISPLAY/1 (Ra_1.2), DISPLAY/2 (Ra_2.2), DISPLAY/3 (Ra_3.2), DISPLAY/4 (Ra_4.2), DISPLAY/5 (Ra_5.2), DISPLAY/6 (Ra_6.2), DISPLAY/7 (Ra_7.2)
CAL_A: SAMD (U301.28), Interface (U501.1)
CAL_B: SAMD (U301.29), Interface (U501.2)
CAL_C: SAMD (U301.30), Interface (U501.3)
CAL_IN: SAMD (U301.27), Interface (J2.1 R501.2)
CAN_CS: SAMD (U301.11), CANbus (U401.17)
CAN_INT: SAMD (U301.26), CANbus (U401.13)
CAN_MISO: SAMD (U301.10), CANbus (U401.16)
CAN_MOSI: SAMD (U301.9), CANbus (U401.15)
CAN_N: Interface (D503.1 J1.4), CANbus (R405.1 U401.3)
CAN_P: Interface (D502.1 J1.3), CANbus (R402.1 U401.4)
CAN_SCLK: SAMD (U301.12), CANbus (U401.14)
Cathode_B: Display Driver (U201.17), DISPLAY/0 (Rb_0.2), DISPLAY/1 (Rb_1.2), DISPLAY/2 (Rb_2.2), DISPLAY/3 (Rb_3.2), DISPLAY/4 (Rb_4.2), DISPLAY/5 (Rb_5.2), DISPLAY/6 (Rb_6.2), DISPLAY/7 (Rb_7.2)
Cathode_C: Display Driver (U201.20), DISPLAY/0 (Rc_0.2), DISPLAY/1 (Rc_1.2), DISPLAY/2 (Rc_2.2), DISPLAY/3 (Rc_3.2), DISPLAY/4 (Rc_4.2), DISPLAY/5 (Rc_5.2), DISPLAY/6 (Rc_6.2), DISPLAY/7 (Rc_7.2)
Cathode_D: Display Driver (U201.23), DISPLAY/0 (Rd_0.2), DISPLAY/1 (Rd_1.2), DISPLAY/2 (Rd_2.2), DISPLAY/3 (Rd_3.2), DISPLAY/4 (Rd_4.2), DISPLAY/5 (Rd_5.2), DISPLAY/6 (Rd_6.2), DISPLAY/7 (Rd_7.2)
Cathode_E: Display Driver (U201.21), DISPLAY/0 (Re_0.2), DISPLAY/1 (Re_1.2), DISPLAY/2 (Re_2.2), DISPLAY/3 (Re_3.2), DISPLAY/4 (Re_4.2), DISPLAY/5 (Re_5.2), DISPLAY/6 (Re_6.2), DISPLAY/7 (Re_7.2)
Cathode_F: Display Driver (U201.16), DISPLAY/0 (Rf_0.2), DISPLAY/1 (Rf_1.2), DISPLAY/2 (Rf_2.2), DISPLAY/3 (Rf_3.2), DISPLAY/4 (Rf_4.2), DISPLAY/5 (Rf_5.2), DISPLAY/6 (Rf_6.2), DISPLAY/7 (Rf_7.2)
Cathode_G: Display Driver (U201.18), DISPLAY/0 (Rg_0.2), DISPLAY/1 (Rg_1.2), DISPLAY/2 (Rg_2.2), DISPLAY/3 (Rg_3.2), DISPLAY/4 (Rg_4.2), DISPLAY/5 (Rg_5.2), DISPLAY/6 (Rg_6.2), DISPLAY/7 (Rg_7.2)
DEBUG_LED: SAMD (U301.15), Interface (R512.2)
~{RESET}: SAMD (U301.40), Interface (P1.10 R507.2 R508.2)
SCLK: SAMD (R302.1 U301.14), Display Driver (U201.14)
SDI: SAMD (R301.1 U301.13), Display Driver (U201.1)
SWCLK: SAMD (U301.45), Interface (P1.4 R509.1)
SWDIO: SAMD (U301.46), Interface (P1.2)
SWS1: SAMD (U301.24), Interface (C505.1 R503.1)
SWS2: SAMD (U301.25), Interface (C507.1 R506.1)
USB_N: SAMD (U301.33), Interface (D501.2 J3.2)
USB_P: SAMD (U301.34), Interface (D501.3 J3.3)